# Altium schematic sheet Main.SchDoc
size A4; Author: Michał Kowalik; CompanyName: AGH; Engineer: dr inż. Piotr Otfinowski; DocumentNumber: 1; Revision: Rev; SheetNumber: 1; SheetTotal: 6; ProjectName: Project Name
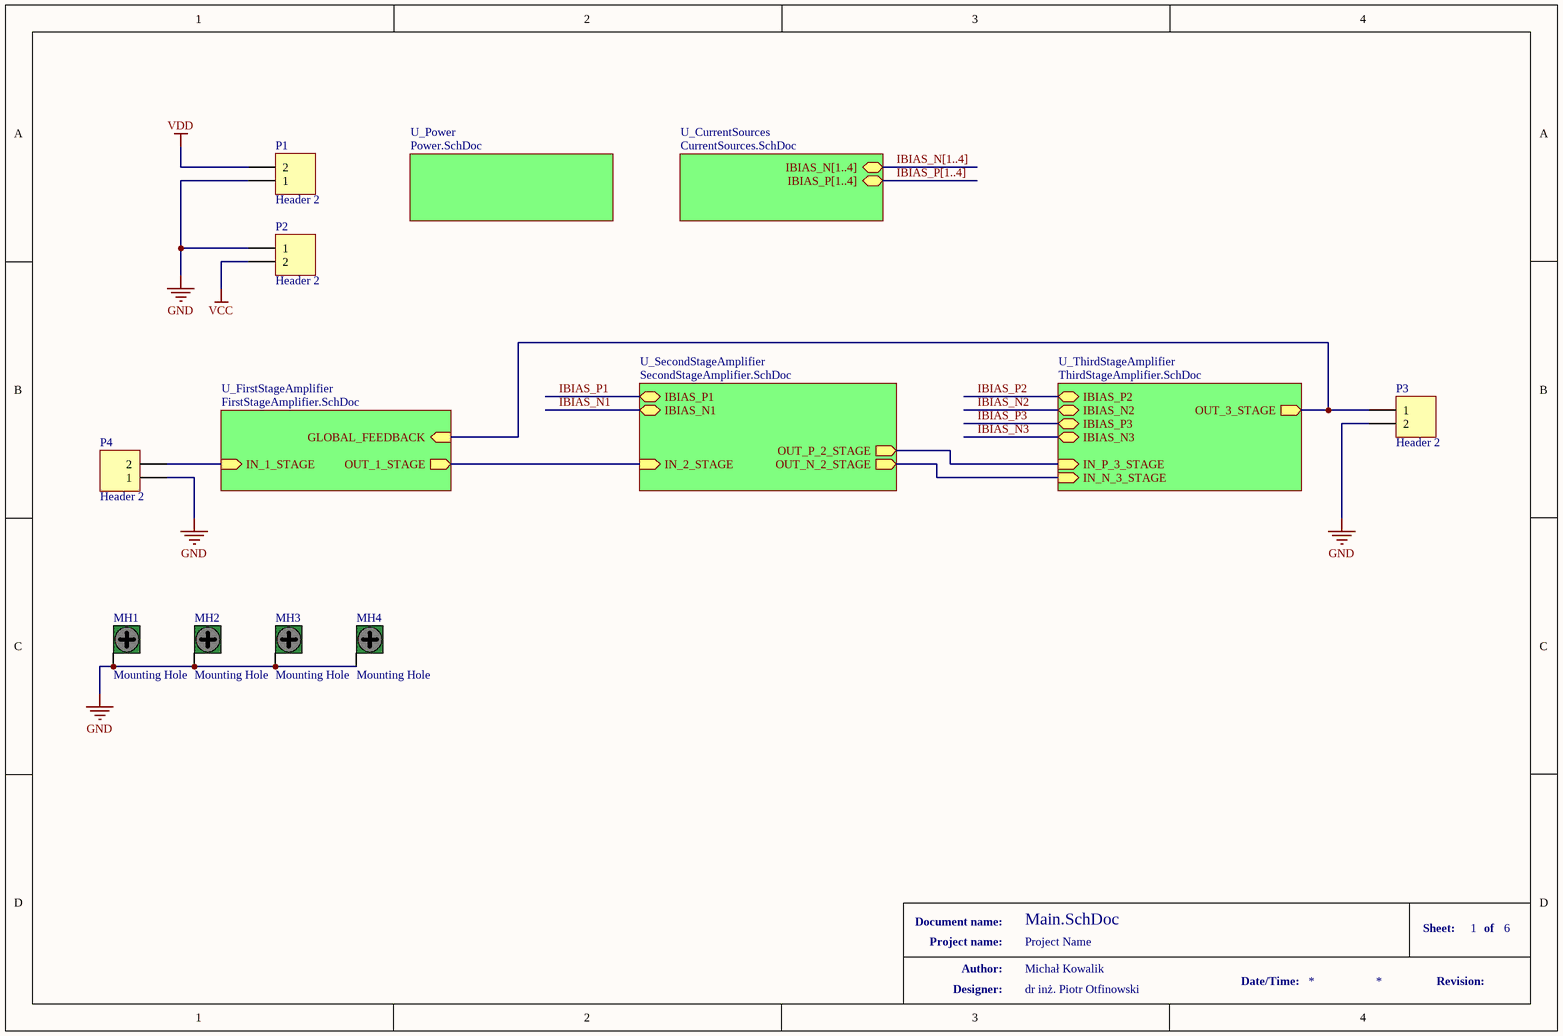
[diagram p0: Main.SchDoc]

## Parts
MH1  Mounting Hole  [MOUNTING HOLE 3mm]  (no BOM)
MH2  Mounting Hole  [MOUNTING HOLE 3mm]  (no BOM)
MH3  Mounting Hole  [MOUNTING HOLE 3mm]  (no BOM)
MH4  Mounting Hole  [MOUNTING HOLE 3mm]  (no BOM)
P1  Header 2  [DG300-5.0-02P-13]
P2  Header 2  [DG300-5.0-02P-13]
P3  Header 2  [DG330-5.0-02P]
P4  Header 2  [DG300-5.0-02P-13]

## Sub-sheets
U_CurrentSources = CurrentSources.SchDoc: IBIAS_N[1..4] (bidir), IBIAS_P[1..4] (bidir)
U_FirstStageAmplifier = FirstStageAmplifier.SchDoc: GLOBAL_FEEDBACK (in), IN_1_STAGE (in), OUT_1_STAGE (out)
U_Power = Power.SchDoc: no entries
U_SecondStageAmplifier = SecondStageAmplifier.SchDoc: IN_2_STAGE (in), OUT_N_2_STAGE (out), OUT_P_2_STAGE (out), IBIAS_P1 (bidir), IBIAS_N1 (bidir)
U_ThirdStageAmplifier = ThirdStageAmplifier.SchDoc: IBIAS_P2 (bidir), IBIAS_N2 (bidir), IN_N_3_STAGE (in), IN_P_3_STAGE (in), IBIAS_P3 (bidir), OUT_3_STAGE (out), IBIAS_N3 (bidir)

## Nets
GND: MH1.MOUNTING MH2.MOUNTING MH3.MOUNTING MH4.MOUNTING P1.1 P2.1 P3.2 P4.1
VCC: P2.2
VDD: P1.2
IBIAS_N1: sheet U_SecondStageAmplifier/IBIAS_N1
IBIAS_N2: sheet U_ThirdStageAmplifier/IBIAS_N2
IBIAS_N3: sheet U_ThirdStageAmplifier/IBIAS_N3
IBIAS_P1: sheet U_SecondStageAmplifier/IBIAS_P1
IBIAS_P2: sheet U_ThirdStageAmplifier/IBIAS_P2
IBIAS_P3: sheet U_ThirdStageAmplifier/IBIAS_P3
NetP3_1: P3.1 ; sheet U_ThirdStageAmplifier/OUT_3_STAGE, sheet U_FirstStageAmplifier/GLOBAL_FEEDBACK
NetP4_2: P4.2 ; sheet U_FirstStageAmplifier/IN_1_STAGE
(unnamed): sheet U_ThirdStageAmplifier/IN_N_3_STAGE, sheet U_SecondStageAmplifier/OUT_N_2_STAGE
(unnamed): sheet U_ThirdStageAmplifier/IN_P_3_STAGE, sheet U_SecondStageAmplifier/OUT_P_2_STAGE
(unnamed): sheet U_SecondStageAmplifier/IN_2_STAGE, sheet U_FirstStageAmplifier/OUT_1_STAGE

## Buses and harness runs
bus IBIAS_N[1..4] = sheet U_CurrentSources/IBIAS_N[1..4]
bus IBIAS_P[1..4] = sheet U_CurrentSources/IBIAS_P[1..4]

## Notes on the sheet
- Document name:
- Project name:
- Author:
- Date/Time:
- Sheet:
- Revision:
- of
- Designer:

## Library data of the parts
P1-P4 = Header 2: Header, 2-Pin; LatestRevisionDate: 17-Jul-2002; LatestRevisionNote: Re-released for DXP Platform.; Publisher: Altium Limited